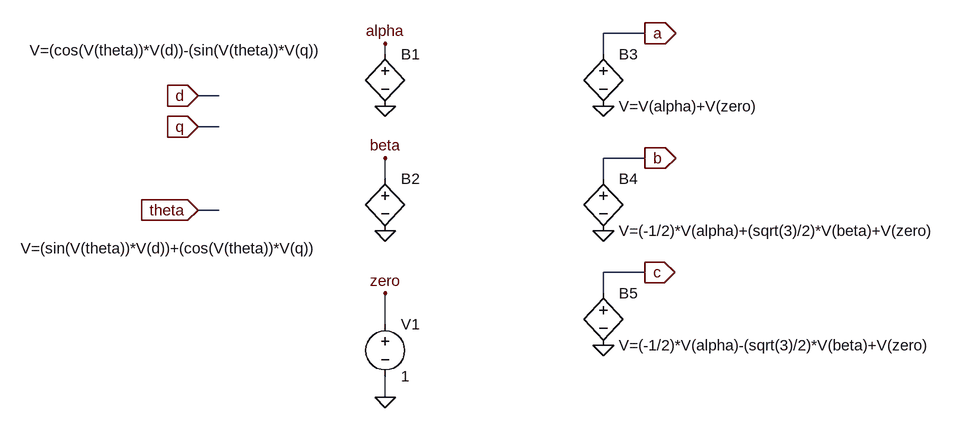
[diagram p0: schematic dqtoabc.asc]
dqtoabc.asc, the LTspice schematic file:
Version 4
SHEET 1 2204 680
WIRE 832 0 768 0
WIRE 432 32 432 16
WIRE 768 32 768 0
WIRE 176 96 144 96
WIRE 176 144 144 144
WIRE 832 192 768 192
WIRE 432 224 432 192
WIRE 768 224 768 192
WIRE 176 272 144 272
WIRE 832 368 768 368
WIRE 768 400 768 368
WIRE 432 448 432 400
WIRE 432 560 432 528
FLAG 144 96 d
IOPIN 144 96 In
FLAG 144 144 q
IOPIN 144 144 In
FLAG 144 272 theta
IOPIN 144 272 In
FLAG 432 16 alpha
FLAG 432 192 beta
FLAG 432 112 0
FLAG 432 304 0
FLAG 432 400 zero
FLAG 432 560 0
FLAG 832 0 a
IOPIN 832 0 Out
FLAG 832 192 b
IOPIN 832 192 Out
FLAG 832 368 c
IOPIN 832 368 Out
FLAG 768 304 0
FLAG 768 112 0
FLAG 768 480 0
SYMBOL bv 432 16 R0
WINDOW 3 -547 10 Left 2
SYMATTR Value V=(cos(V(theta))*V(d))-(sin(V(theta))*V(q))
SYMATTR InstName B1
SYMBOL bv 432 208 R0
WINDOW 3 -561 123 Left 2
SYMATTR Value V=(sin(V(theta))*V(d))+(cos(V(theta))*V(q))
SYMATTR InstName B2
SYMBOL bv 768 16 R0
SYMATTR InstName B3
SYMATTR Value V=V(alpha)+V(zero)
SYMBOL bv 768 208 R0
SYMATTR InstName B4
SYMATTR Value V=(-1/2)*V(alpha)+(sqrt(3)/2)*V(beta)+V(zero)
SYMBOL voltage 432 432 R0
WINDOW 123 0 0 Left 0
WINDOW 39 0 0 Left 0
SYMATTR InstName V1
SYMATTR Value 1
SYMBOL bv 768 384 R0
SYMATTR InstName B5
SYMATTR Value V=(-1/2)*V(alpha)-(sqrt(3)/2)*V(beta)+V(zero)

The netlist it stands for:
* dqtoabc.asc
B1 alpha 0 V=(cos(V(theta))*V(d))-(sin(V(theta))*V(q))
B2 beta 0 V=(sin(V(theta))*V(d))+(cos(V(theta))*V(q))
B3 a 0 V=V(alpha)+V(zero)
B4 b 0 V=(-1/2)*V(alpha)+(sqrt(3)/2)*V(beta)+V(zero)
V1 zero 0 1
B5 c 0 V=(-1/2)*V(alpha)-(sqrt(3)/2)*V(beta)+V(zero)
.backanno
.end